# EAGLE design ESPW12_taga (EAGLE 6.5.0)
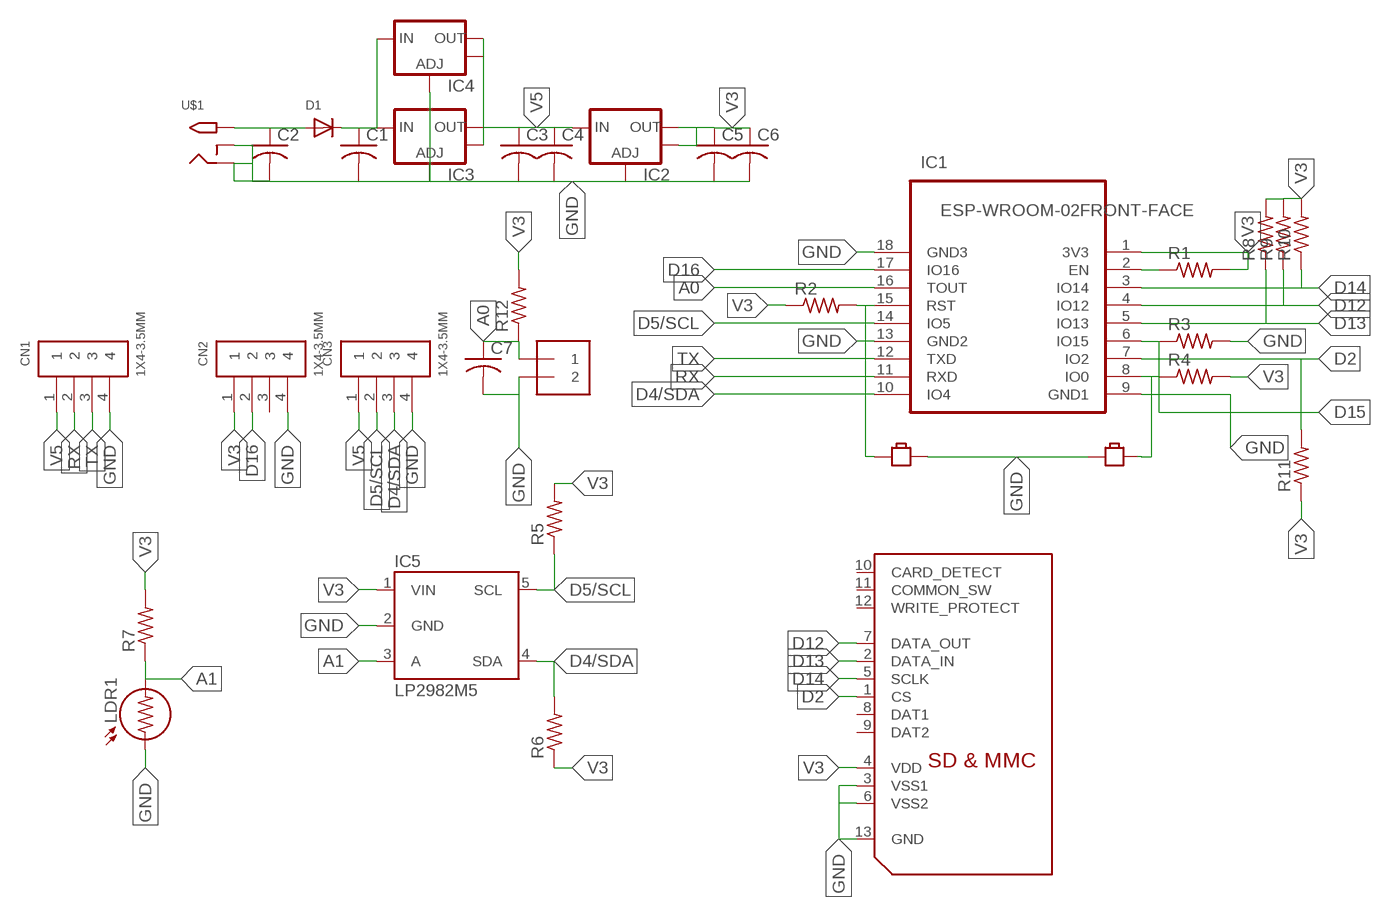
[diagram p0: schematic, sheet 1]

## Parts
B1  BUTTON-SMD-2P  [BUTTON_2P_SMD]
B2  BUTTON-SMD-2P  [BUTTON_2P_SMD]
C1  C-USC0805  [C0805]
C2  C-USC0805  [C0805]
C3  C-USC0805  [C0805]
C4  C-USC0805  [C0805]
C5  C-USC0805  [C0805]
C6  C-USC0805  [C0805]
C7  C-USC0805  [C0805]
CN1  1X4-3.5MM  [1X04-3.5MM]
CN2  1X4-3.5MM  [1X04-3.5MM]
CN3  1X4-3.5MM  [1X04-3.5MM]
D1  DIODESMA  [SMADIODE]
IC1  ESP-WROOM-02FRONT-FACE  [FRONT-FACE]
IC2  V_REG_LM1117SOT223  [SOT223]
IC3  V_REG_LM1117SOT223  [SOT223]
IC4  V_REG_LM1117SOT223  [SOT223]
IC5  LP2982M5  [SOT23-5]
J1  1X2-3.5MM  [1X2-3.5MM]
LDR1  LDR5MM  [LDR338-54C]
R1  R-US_R0805  [R0805]
R2  R-US_R0805  [R0805]
R3  R-US_R0805  [R0805]
R4  R-US_R0805  [R0805]
R5  R-US_R0805  [R0805]
R6  R-US_R0805  [R0805]
R7  R-US_R0805  [R0805]
R8  R-US_R0805  [R0805]
R9  R-US_R0805  [R0805]
R10  R-US_R0805  [R0805]
R11  R-US_R0805  [R0805]
R12  R-US_R0805  [R0805]
U$1  2.1MMJACKTHM  [PJ-102A]
U$2  SDMMCSCDA  [SCDA]

## Nets
A0: C7.1 IC1.16(TOUT) J1.1 R12.1
A1: IC5.3(A) LDR1.2 R7.1
D0: B2.P$2 IC1.8(IO0) R4.1
D2: IC1.7(IO2) R11.2 U$2.1(CS)
D4/SDA: CN3.3 IC1.10(IO4) IC5.4(SDA) R6.2
D5/SCL: CN3.2 IC1.14(IO5) IC5.5(SCL) R5.1
D12: IC1.4(IO12) R9.1 U$2.7(DATA_OUT)
D13: IC1.5(IO13) R8.1 U$2.2(DATA_IN)
D14: IC1.3(IO14) R10.1 U$2.5(SCLK)
D15: IC1.6(IO15) R3.1
D16: CN2.2 IC1.17(IO16)
GND: B1.P$2 B2.1 C1.2 C2.2 C3.2 C4.2 C5.2 C6.2 C7.2 CN1.4 CN2.4 CN3.4 IC1.9(GND1) IC1.13(GND2) IC1.18(GND3) IC2.1(ADJ) IC3.1(ADJ) IC4.1(ADJ) IC5.2(GND) J1.2 LDR1.1 R3.2 U$1.RING U$1.RING_SW U$2.3(VSS1) U$2.6(VSS2) U$2.13(GND)
N$1: B1.1 IC1.15(RST) R2.2
N$2: C2.1 D1.A U$1.TIP
N$3: C1.1 D1.C IC3.3(IN) IC4.3(IN)
N$5: IC1.2(EN) R1.1
RX: CN1.2 IC1.11(RXD)
TX: CN1.3 IC1.12(TXD)
V3: C5.1 C6.1 CN2.1 IC1.1(3V3) IC2.2(OUT) IC2.4(OUT) IC5.1(VIN) R1.2 R2.1 R4.2 R5.2 R6.1 R7.2 R8.2 R9.2 R10.2 R11.1 R12.2 U$2.4(VDD)
V5: C3.1 C4.1 CN1.1 CN3.1 IC2.3(IN) IC3.2(OUT) IC3.4(OUT) IC4.2(OUT) IC4.4(OUT)
Unconnected: CN2.3 U$2.8(DAT1) U$2.9(DAT2) U$2.10(CARD_DETECT) U$2.11(COMMON_SW) U$2.12(WRITE_PROTECT)

## Library data of the parts
B1 B2 = Itead_BP_110825:BUTTON-SMD-2P: BAS014
C1-C7 = adafruit:C-US: CAPACITOR, American symbol
CN1-CN3 = adafruit:1X4: 4-pin connector
D1 = adafruit:DIODE: Diode SMADIODE - SMA Surface Mount Package 20V 1A Schottky Diode Digikey: 641-1014-6-ND DO-1N4148 - Through Hole Small Current Diode SOD-123 20V 1 A (.5mV Vf) Schottky Diode - Digikey: MBRX120TPMSCT-ND SOD-323 10V 570mA (.38mV Vf, 3ns) Schottky Diode - Digikey: ZLLS410CT-ND SOD-523 30V 30mA Schottky Diode (RB751S-40TE61) - Digikey: RB751S-40TE61CT-ND SOT23-R/W - SOT23 Package (R = Solder Paste/Reflow Ovens, W = Hand-Soldering) BAT54Film 40V 300mA - Digikey: 497-7162-1-ND
IC1 = esp-wroom-02:ESP-WROOM-02: WiFi module - ESP-WROOM-02
IC2-IC4 = SparkFun:V_REG_LM1117: Voltage Regulator LM1117 Standard adjustable voltage regulator but in SMD form. Spark Fun Electronics SKU : COM-00595
IC5 = v-reg-3:LP2982: National Semiconductor <http://www.national.com> Micropower Linear Regulator 50mA regulated output, Vin 16V max., ultra-low dropout of 120mV @ 50mA, 1µA standby current, low noise
J1 = adafruit:1X2: 3.5mm Terminal block http://www.ladyada.net/library/pcb/eaglelibrary.html
LDR1 = gm-resistors:LDR
R1-R12 = adafruit:R-US_: RESISTOR, American symbol
U$1 = adafruit:2.1MMJACK: 2.1mm x 5.5mm THM DC jack with internal switch. Digikey part #PJ-102A, 4UCON part #05537 2.1mm x 5.5mm SMT DC jack with internal switch. Digikey part #PJ-002A-SMT, 4UCON part #03267 By microbuilder.eu & adafruit.com
U$2 = adafruit:SDMMC: SD MMC Card holder 4UCON part #06132 - easy to solder

## Board
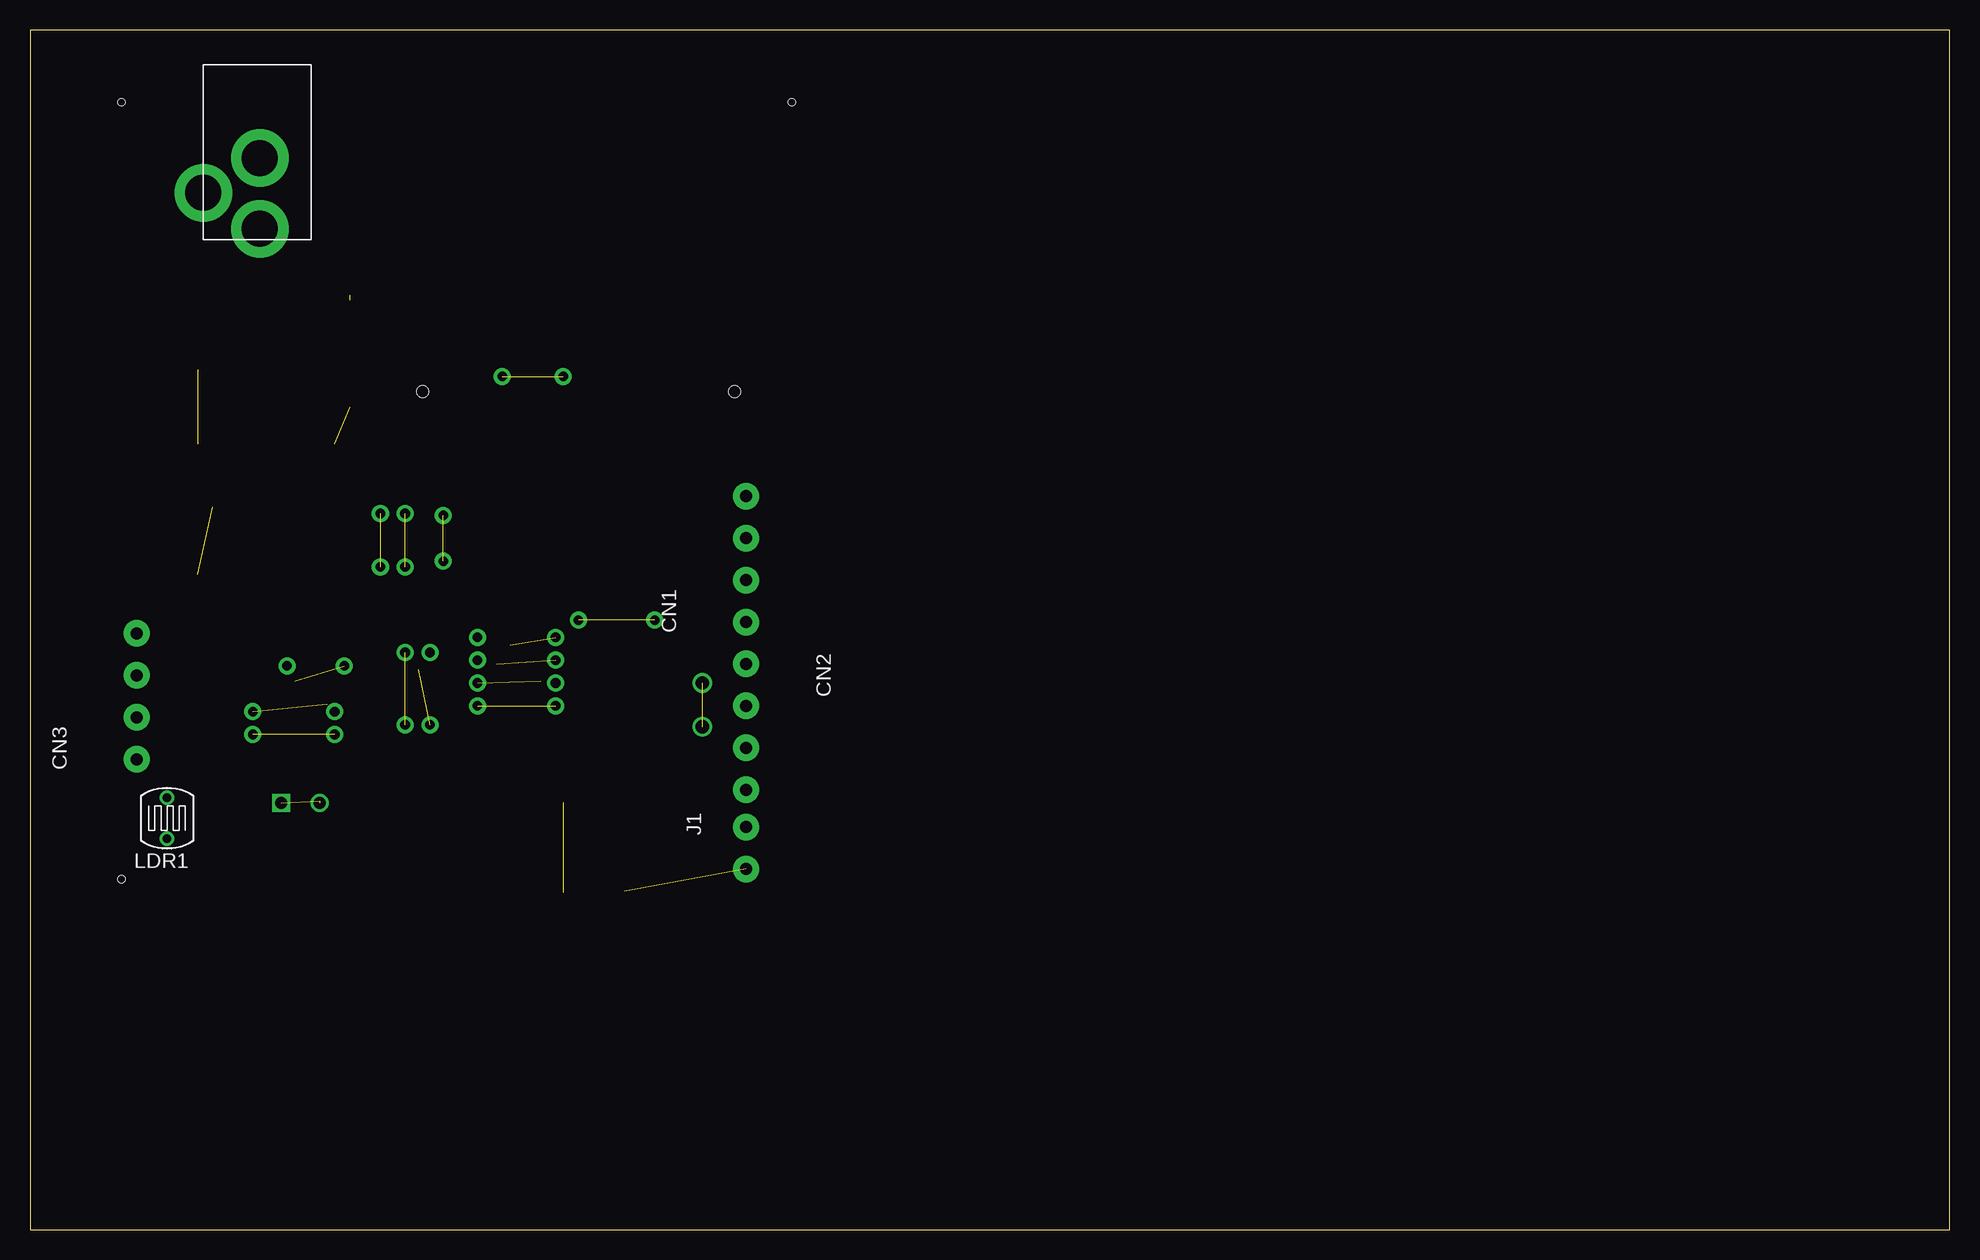
[diagram p1: board, top side]
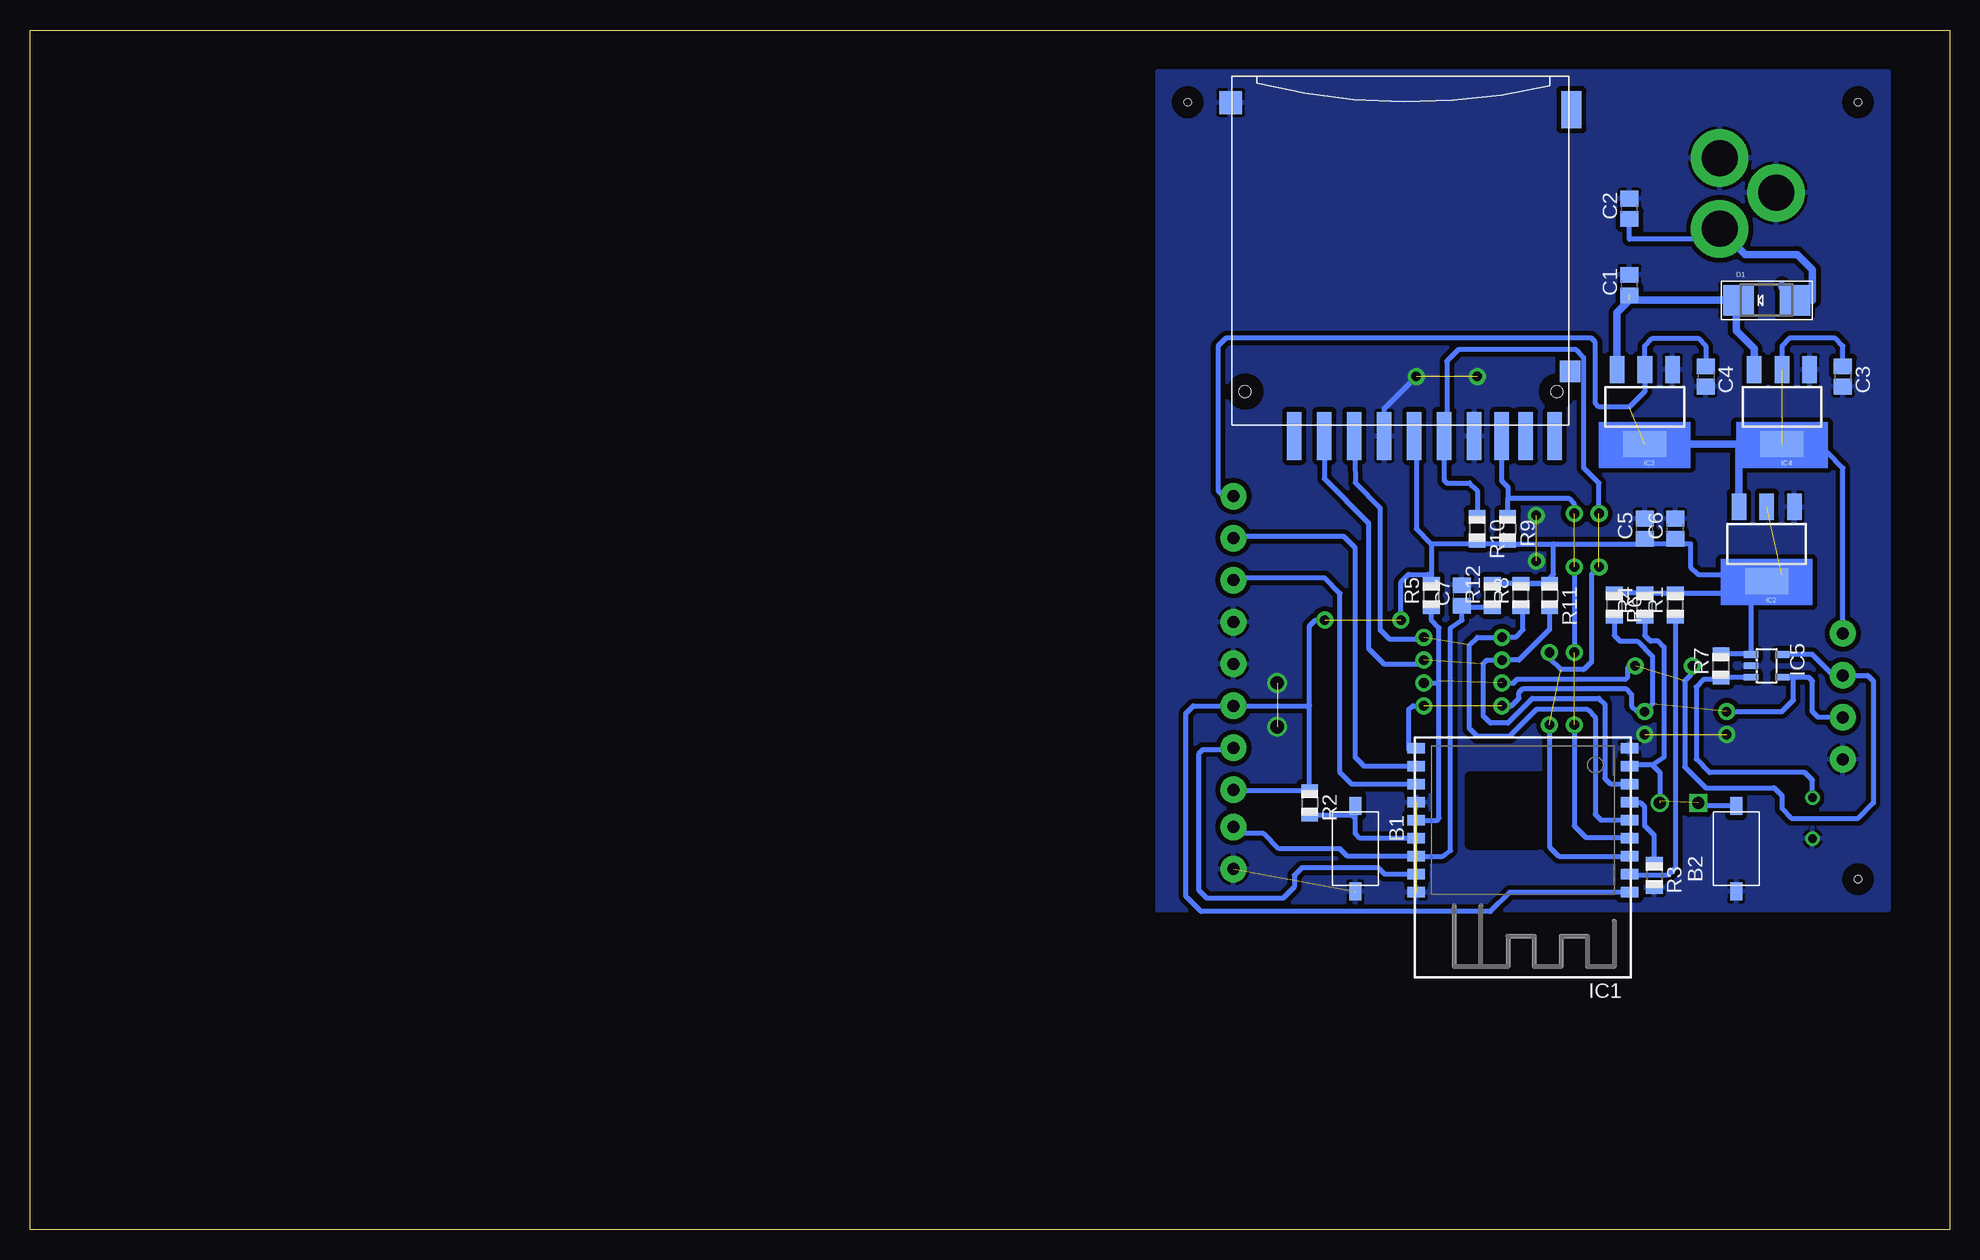
[diagram p2: board, bottom side, seen from below]

Size 160 x 100 mm. Coordinates in mm from the lower left corner, seen from the top.
Outline: 0,0 160,0 160,100 0,100 0,0
Copper layers (1*16): Top 0.035mm / dielectric 1.5mm / Bottom 0.035mm
Design rules "default": minimum track width 10mil, minimum drill 24mil, track to track 8mil, track to pad 8mil, pad to pad 8mil, via to via 8mil, smd to smd 8mil, copper to edge 40mil, drill to drill 8mil, minimum pad ring 10mil, minimum via ring 8mil, stop-mask expansion 4mil, vias tented up to drill 0mil, thermal gap 10mil
Holes 0.6 mm at 7.62,93.98 63.5,93.98 7.62,29.21

### Footprints (pad centres in the part's own frame; a part is rotated, then mirrored left to right if it is on the bottom)
BUTTON_2P_SMD = smd 1.524 x 1.016: 1 -3.556,0; P$2 3.556,0
C0805 = smd 1.3 x 1.5: 1 -0.85,0; 2 0.85,0
1X04-3.5MM = drill 1 pad 2.184: 1 -5.25,0; 2 -1.75,0; 3 1.75,0; 4 5.25,0
SMADIODE = smd 2.54 x 2.54: A 2.349,0; C -2.349,0
FRONT-FACE = smd 1.485 x 0.9: 1 -8.893,4.9; 2 -8.893,3.4; 3 -8.893,1.9; 4 -8.893,0.4; 5 -8.893,-1.1; 6 -8.893,-2.6; 7 -8.893,-4.1; 8 -8.893,-5.6; 9 -8.893,-7.1; 10 8.893,-7.1; 11 8.893,-5.6; 12 8.893,-4.1; 13 8.893,-2.6; 14 8.893,-1.1; 15 8.893,0.4; 16 8.893,1.9; 17 8.893,3.4; 18 8.893,4.9
SOT223 = smd 1.219 x 2.235: 1 -2.311,-3.099; 2 0,-3.099; 3 2.311,-3.099 | smd 3.6 x 2.2: 4 0,3.099
SOT23-5 = smd 0.55 x 1.2: 1 -0.95,-1.3; 2 0,-1.3; 3 0.95,-1.3; 4 0.95,1.3; 5 -0.95,1.3
1X2-3.5MM = drill 1 pad 2.184: 1 1.8,0; 2 -1.7,0
LDR338-54C = drill 0.7: 1 0,1.702; 2 0,-1.702
R0805 = smd 1.1 x 1.4: 1 -1,0; 2 1,0
PJ-102A = drill 3 pad 4.8: RING 0.1,-3.39; RING_SW -4.6,-6.29; TIP 0.1,-9.29
SCDA = smd 1.2 x 4: 1 6.4,3.7; 2 3.9,3.7; 3 1.4,3.7; 4 -1.1,3.7; 5 -3.6,3.7; 6 -6.1,3.7; 7 -8.4,3.7; 8 -10.4,3.7; 9 8.9,3.7; 10 -12.8,3.7 | smd 1.7 x 1.8: 11 -14.1,-1.7 | smd 1.7 x 3.1: 12 -14.2,-23.5 | smd 1.9 x 1.9: 13 14.2,-24.1 | hole 1: -13,0; 13,0

### Placement (x,y rotation side)
B1  49.53,31.75 270 bottom
B2  17.78,31.75 90 bottom
C1  26.67,78.74 90 bottom
C2  26.67,85.09 90 bottom
C3  8.89,71.12 270 bottom
C4  20.32,71.12 270 bottom
C5  25.4,58.42 90 bottom
C6  22.86,58.42 90 bottom
C7  40.64,52.86 90 bottom
CN1  59.69,55.88 270 top
CN2  59.69,41.91 90 top
CN3  8.89,44.45 270 top
D1  15.24,77.47 0 bottom
IC1  35.56,33.02 180 bottom
IC2  15.24,57.15 180 bottom
IC3  25.4,68.58 180 bottom
IC4  13.97,68.58 180 bottom
IC5  15.24,46.99 270 bottom
J1  59.69,31.75 90 top
LDR1  11.43,34.29 180 top
R1  22.86,52.07 90 bottom
R2  53.34,35.56 270 bottom
R3  24.61,29.53 270 bottom
R4  25.4,52.07 90 bottom
R5  43.18,52.86 90 bottom
R6  27.94,52.07 270 bottom
R7  19.05,46.99 90 bottom
R8  35.72,52.86 90 bottom
R9  36.83,58.42 270 bottom
R10  39.37,58.42 270 bottom
R11  33.34,52.86 270 bottom
R12  38.1,52.86 90 bottom
U$1  19.05,92.71 0 top
U$2  45.72,69.85 180 bottom

### Tracks (layer width: path | path; a pad name or v marks a point on that pad's centre or on a via)
A0
  Bottom 0.406: J1.1 59.16,33.02 57.15,33.02 55.88,31.75 50.8,31.75 50.17,31.12 IC1.16 42.22,31.12 41.59,31.59 41.59,50.16 40.64,50.8 C7.1 | 40.49,52.34 C7.1 | R12.1 40.49,51.86 C7.1
A1
  Bottom 0.406: IC5.3 19,46.04 R7.1 19.16,45.88 20.48,45.88 21.11,45.24 21.11,39.21 20,38.1 12.06,38.1 11.43,37.47 LDR1.2
D0  (via drill 1 pad 0.41)  (2 unrouted)
  Bottom 0.406: R4.1 25.4,49.53 24.92,49.05 24.29,49.05 23.81,48.58 23.81,39.37 24.77,38.73 | 24.77,38.73 26.55,38.73 IC1.8 | B2.P$2 20.95,35.31 v20.95,35.56 | 24.77,38.73 24.13,38.1 v24.13,35.56
D2  (via drill 0.8 pad 1.42)  (1 unrouted)
  Bottom 0.406: U$2.1 52.12,62.6 48.42,58.9 48.42,48.42 47.15,47.15 43.97,47.15 v43.81,47.47 | 26.85,37.31 IC1.7 26.7,37.15 28.26,37.15 28.73,37.62 28.73,43.81 29.21,44.29 34.77,44.29 36.83,42.23 38.26,42.23 38.89,42.86 38.89,47.15 38.58,47.47 v37.31,47.47 35.88,47.47 33.34,50.01 R11.2
D4/SDA  (via drill 0.8 pad 1.42)  (2 unrouted)
  Bottom 0.406: CN3.3 10.95,42.7 11.43,43.18 11.43,45.72 11.75,46.04 13.02,46.04 | 13.02,46.04 IC5.4 | v18.57,43.18 13.97,43.18 13.02,44.13 13.02,46.04 | R6.2 27.94,49.53 27.46,49.05 26.04,49.05 24.77,47.78 24.77,43.81 v25.4,43.18 26.04,43.18 26.51,43.66 26.51,44.61 26.99,45.09 35.56,45.09 35.88,44.77 35.88,44.29 36.51,43.66 v37.31,43.66 | IC1.10 44.97,40.12 45.09,40.01 45.09,43.34 44.77,43.66 v43.81,43.66
D5/SCL  (via drill 0.8 pad 1.42)  (2 unrouted)
  Bottom 0.406: IC1.14 42.72,34.12 42.55,34.29 42.55,45.72 | IC5.5 11.43,47.94 9.69,46.2 CN3.2 6.83,46.2 6.35,45.72 6.35,35.56 7.62,34.29 13.18,34.29 13.97,35.08 13.97,36.2 14.61,36.83 20.32,36.83 22.07,38.58 22.07,45.72 21.59,46.2 v21.43,46.99 | 42.55,45.72 42.55,50.16 43.18,50.8 R5.1 | v43.81,45.56 42.7,45.56 42.55,45.72 | v37.31,45.56 36.35,45.56 36.04,45.88 26.99,45.88 26.83,46.04 26.83,46.83 26.67,46.99 v26.19,46.99
D12  (via drill 0.8 pad 1.42)  (2 unrouted)
  Bottom 0.406: 36.83,60.96 36.83,61.91 37.32,62.4 U$2.7 | R9.1 36.83,60.96 | 36.83,60.96 31.75,60.96 31.27,60.48 v31.27,59.69 | v31.27,55.24 v31.27,48.1 | v31.27,42.07 31.27,33.66 30.32,32.7 26.75,32.7 IC1.4
D13  (via drill 0.8 pad 1.42)  (1 unrouted)
  Bottom 0.406: U$2.2 49.53,62.23 47.47,60.17 47.47,50.01 46.67,49.21 43.97,49.21 v43.81,49.37 | IC1.5 29.05,34.13 29.53,34.61 29.53,42.7 30.16,43.34 34.45,43.34 36.67,41.12 39.37,41.12 40.01,41.75 40.01,48.74 39.37,49.37 v37.31,49.37 36.2,49.37 35.56,50.01 35.56,51.7 R8.1
D14  (via drill 0.8 pad 1.42)  (2 unrouted)
  Bottom 0.406: R10.1 39.37,61.59 40.01,62.23 41.91,62.23 42.12,62.44 U$2.5 41.91,66.36 41.91,72.39 40.96,73.34 31.11,73.34 30.48,72.71 30.48,63.5 29.21,62.23 v29.21,59.69 | v29.21,55.24 29.84,54.61 29.84,47.31 30.48,46.67 32.38,46.67 33.34,47.62 v33.34,48.1 | v33.34,42.07 33.34,31.91 32.54,31.11 IC1.3
D15
  Bottom 0.406: R3.1 24.61,32.86 25.4,33.66 25.4,35.24 25.72,35.56 26.61,35.56 IC1.6
D16
  Bottom 0.406: IC1.17 47.08,29.62 47.62,30.16 53.98,30.16 54.61,29.53 54.61,28.57 55.56,27.62 61.91,27.62 62.55,28.26 62.55,39.69 62.23,40.01 59.84,40.01 CN2.2
GND  (via drill 0.8 pad 1.42, 1.1)  (6 unrouted)
  Bottom 0.406: U$2.3 47.12,68.45 v44.45,71.12
  other vias: 18.57,41.27 25.4,41.27 34.45,59.53 34.45,55.72 39.37,71.12 56.04,41.91 56.04,45.56
  pour Bottom (isolate 0.406): 5.08,96.52 66.04,96.52 66.04,26.67 5.08,26.67
N$1
  Bottom 0.406: IC1.15 49.13,32.62 49.53,33.02 49.53,34.29 | 49.53,34.29 B1.1 | R2.2 49.8,34.56 49.53,34.29
N$2
  Bottom 0.406: U$1.TIP 20.02,82.55 26.67,82.55 C2.1
  Bottom 0.61: 13.97,78.74 13.97,78.55 D1.A 11.43,77.47 11.43,80.01 12.7,81.28 17.01,81.28 U$1.TIP
N$3  (1 unrouted)
  Bottom 0.61: IC4.3 16.28,73.43 17.78,74.93 17.78,77.28 | 17.78,77.28 D1.C | 17.78,77.28 17.97,77.47 26.67,77.47 27.71,76.43 IC3.3
N$5
  Bottom 0.406: R1.1 22.86,30.16 23.5,29.53 26.57,29.53 IC1.2
RX
  Bottom 0.406: IC1.11 48.78,38.62 49.53,39.37 49.53,56.83 50.48,57.78 59.53,57.78 CN1.2
TX
  Bottom 0.406: IC1.12 49.82,37.12 50.8,38.1 50.8,53.02 52.07,54.29 59.53,54.29 CN1.3
V3  (via drill 0.8 pad 1.42)  (2 unrouted)
  Bottom 0.406: 17.78,54.61 20.95,54.61 21.59,55.24 21.59,57.15 22.44,57.15 C6.1 22.86,57.15 24.98,57.15 C5.1 25.82,57.15 33.02,57.15 | 17.78,54.61 16.51,54.61 | 16.51,54.61 13.97,54.61 IC2.4 | 17.78,54.61 18.1,54.29 18.1,53.34 18.37,53.07 R1.2 R4.2 R6.1 | CN2.1 59.59,36.56 R2.1 53.34,43.66 | 44.45,66.04 44.56,66.15 U$2.4 44.45,65.98 44.45,58.42 43.18,57.15 | 36.83,57.15 39.37,57.15 | 39.37,57.15 43.18,57.15 | R9.2 36.83,57.15 | R10.2 39.37,57.15 | 36.83,57.15 33.02,57.15 | IC5.1 16.59,47.99 | 16.59,47.99 R7.2 | 16.59,47.99 16.51,48.07 16.51,54.61 | 53.34,43.66 53.34,50.32 52.86,50.8 v52.07,50.8 | 43.18,57.15 R5.2 43.45,54.61 45.09,54.61 45.72,53.98 v45.72,50.8 | IC1.1 36.65,28.12 38.26,26.51 62.39,26.51 63.66,27.78 63.66,43.02 63.02,43.66 53.34,43.66 | R11.1 R8.2 | R8.2 R12.2 | R8.2 33.77,53.86 33.02,54.61 33.02,57.15
V5  (2 unrouted)
  Bottom 0.406: C3.1 8.89,73.66 9.53,74.3 13.34,74.3 13.97,73.66 IC4.2 | C4.1 20.32,73.66 20.95,74.3 24.77,74.3 25.4,73.66 IC3.2 25.4,69.85 26.67,68.58 29.21,68.58 29.53,68.9 29.53,73.98 29.84,74.3 60.33,74.3 60.96,73.66 60.96,61.59 60.64,61.28 59.84,61.28 CN1.1 | CN3.1 8.89,63.5 10.16,64.77 13.26,64.77 IC4.4
  Bottom 0.61: IC3.4 17.78,65.48 | 17.78,65.48 IC4.4 | IC2.3 17.55,65.25 17.78,65.48
(copper drawn outside any net)
  shapes: Bottom area x3